# EAGLE design RAMPS_UPS (EAGLE 7.3.0)
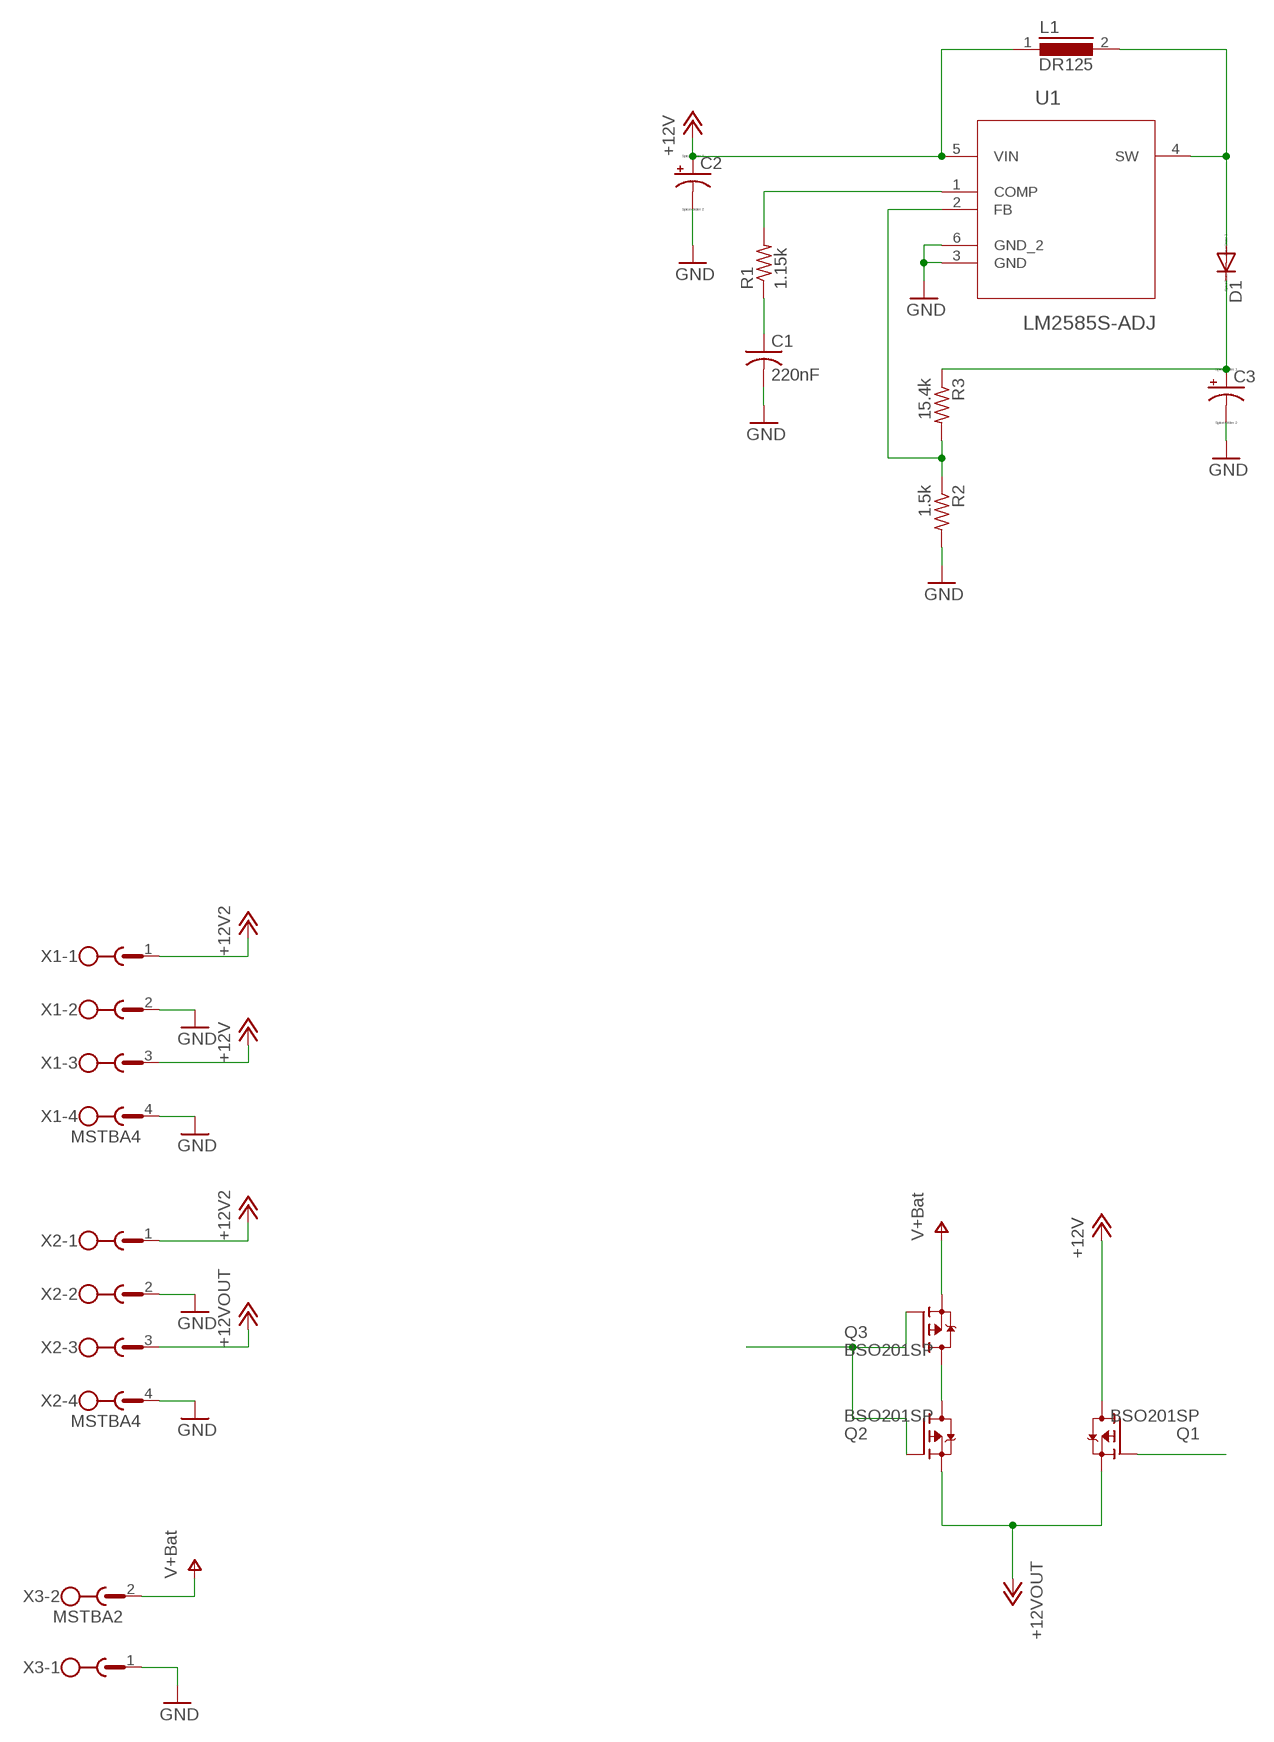
[diagram p0: schematic, sheet 1]

## Parts
C1  220nF  C-USC0805K  [C0805K]
C2  CPOL-USC  [PANASONIC_C]
C3  CPOL-USG  [PANASONIC_G]
D1  DIODE-SMB  [SMB]
L1  DR125  [DR125]
Q1  BSO201SP  [SO-8]
Q2  BSO201SP  [SO-8]
Q3  BSO201SP  [SO-8]
R1  1.15k  R-US_R0805  [R0805]
R2  1.5k  R-US_R0805  [R0805]
R3  15.4k  R-US_R0805  [R0805]
U1  LM2585S-ADJ  [TO170P1435X457-5N]
X1  MSTBA4  [MSTBA4]
X2  MSTBA4  [MSTBA4]
X3  MSTBA2  [MSTBA2]

## Nets
+12V: C2.+ L1.1 U1.5(VIN)
+12V1: Q1.5(D) Q1.6(D) Q1.7(D) Q1.8(D) X1.3 ; supply symbol labelled +12V
+12V2: X1.1 X2.1
+12VOUT: Q1.1(S) Q1.2(S) Q1.3(S) Q2.1(S) Q2.2(S) Q2.3(S) X2.3
GND: C1.2 C2.- C3.- R2.2 U1.3(GND) U1.6(GND_2) X1.2 X1.4 X2.2 X2.4 X3.1
N$1: Q2.5(D) Q2.6(D) Q2.7(D) Q2.8(D) Q3.5(D) Q3.6(D) Q3.7(D) Q3.8(D)
N$2: R2.1 R3.2 U1.2(FB)
N$3: R1.2 U1.1(COMP)
N$4: C1.1 R1.1
N$5: Q2.4(G) Q3.4(G)
N$6: Q1.4(G)
N$7: D1.A L1.2 U1.4(SW)
N$8: C3.+ D1.C
V+: Q3.1(S) Q3.2(S) Q3.3(S) X3.2 ; supply symbol labelled V+Bat
Unconnected: R3.1

## Library data of the parts
C1 = resistor:C-US: CAPACITOR, American symbol
C2 C3 = resistor:CPOL-US: POLARIZED CAPACITOR, American symbol
D1 = diode:DIODE-: DIODE
L1 = inductors:DR125: High Power Density, High Efficiency, Shielded Inductors Source: coiltronics_dr_series.pdf
Q1-Q3 = transistor-fet:BSO201SP: OptiMOS(R)-P Small-Signal-Transistor P-Channel, Enhancement mode, Super Logic Level (2.5 V rated) RDS(on) 8mOhm, ID -14.9 a Source: http://www.infineon.com/upload/Document/cmc_upload/documents/011/3655/BSO201SP_211201.pdf
R1-R3 = resistor:R-US_: RESISTOR, American symbol
U1 = NSC_By_element14_Batch_1.1:LM2585S-ADJ: FLYBACK REGULATOR; MPN: LM2585S-ADJ; OC_FARNELL: 1469182; OC_NEWARK: 41K3722; PACKAGE: TO-263-5; SUPPLIER: National Semiconductor
X1 X2 = con-phoenix-508:MSTBA4: PHOENIX; MF: FARNELL; MPN: 1757268; OC_FARNELL: 3705195; OC_NEWARK: 71C4163
X3 = con-phoenix-508:MSTBA2: PHOENIX; MF: FARNELL; MPN: 1757242; OC_FARNELL: 3705171; OC_NEWARK: 71C4161

## Board
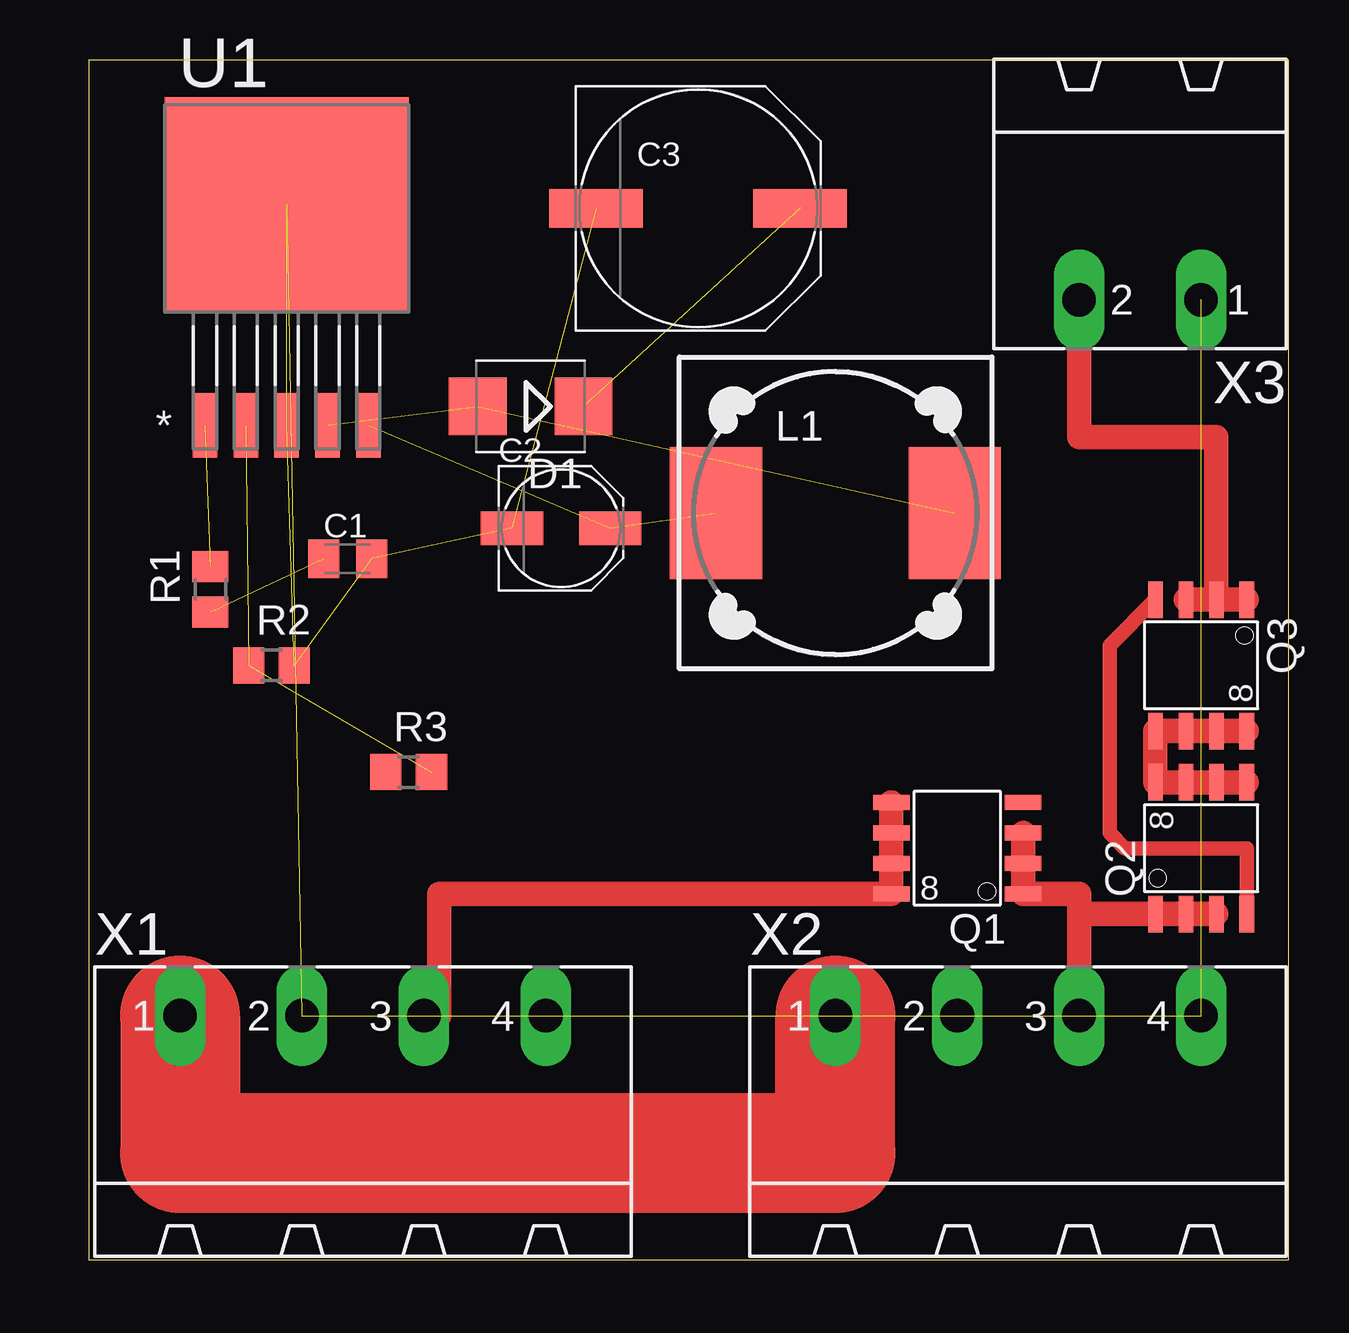
[diagram p1: board, top side]
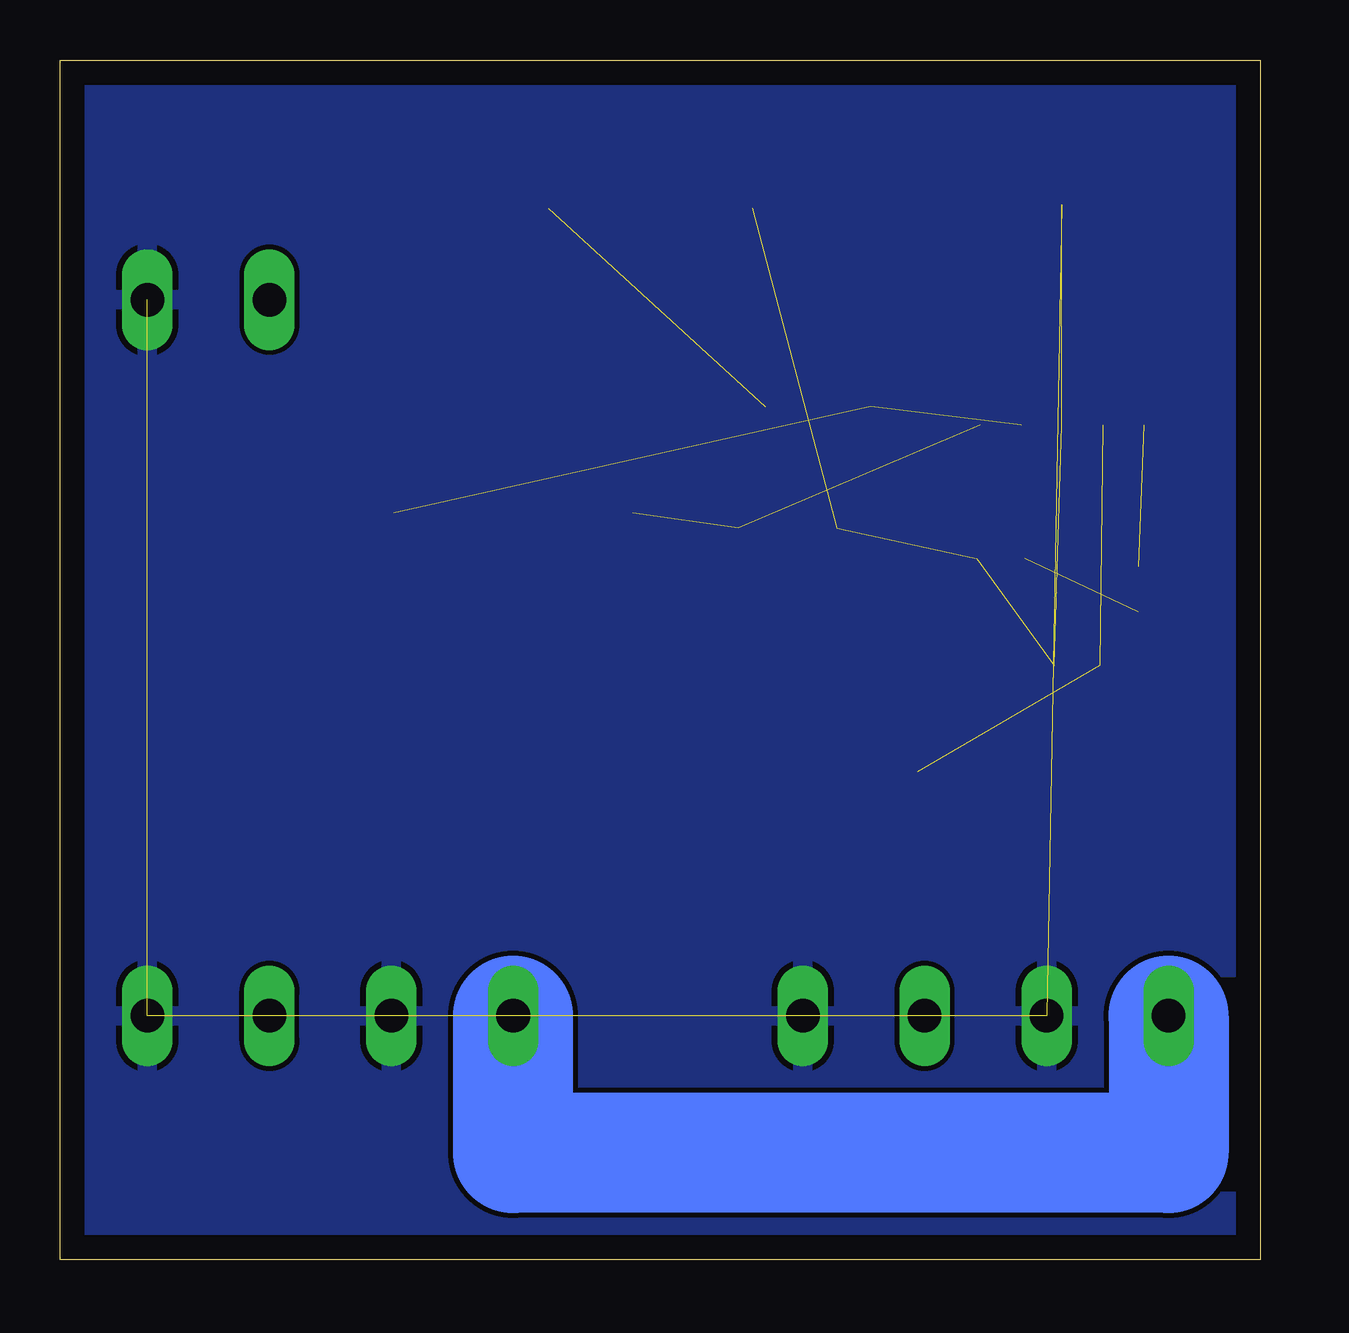
[diagram p2: board, bottom side, seen from below]

Size 50 x 50 mm. Coordinates in mm from the lower left corner, seen from the top.
Outline: 0,0 50,0 50,50 0,50 0,0
Copper layers (1*16): Top 0.035mm / dielectric 1.5mm / Bottom 0.035mm
Design rules "default": minimum track width 10mil, minimum drill 24mil, track to track 8mil, track to pad 8mil, pad to pad 8mil, via to via 8mil, smd to smd 8mil, copper to edge 40mil, drill to drill 8mil, minimum pad ring 10mil, minimum via ring 8mil, stop-mask expansion 4mil, vias tented up to drill 0mil, thermal gap 10mil

### Footprints (pad centres in the part's own frame; a part is rotated, then mirrored left to right if it is on the bottom)
C0805K = smd 1.3 x 1.6: 1 -1,0; 2 1,0
PANASONIC_C = smd 2.6 x 1.4: + 2.05,0; - -2.05,0
PANASONIC_G = smd 3.9 x 1.6: + 4.25,0; - -4.25,0
SMB = smd 2.4 x 2.4: A 2.2,0; C -2.2,0
DR125 = smd 3.85 x 5.5: 1 -4.975,0; 2 4.975,0
SO-8 = smd 1.524 x 0.61: 1 -2.743,1.905; 2 -2.743,0.635; 3 -2.743,-0.635; 4 -2.743,-1.905; 5 2.743,-1.905; 6 2.743,-0.635; 7 2.743,0.635; 8 2.743,1.905
R0805 = smd 1.3 x 1.5: 1 -0.95,0; 2 0.95,0
TO170P1435X457-5N = smd 1.016 x 2.692: 1 -3.404,-9.042; 2 -1.702,-9.042; 3 0,-9.042; 4 1.702,-9.042; 5 3.404,-9.042 | smd 10.16 x 8.941: 6 0,0.152
MSTBA4 = drill 1.397 long: 1 -7.62,5.08; 2 -2.54,5.08; 3 2.54,5.08; 4 7.62,5.08
MSTBA2 = drill 1.397 long: 1 -2.54,5.08; 2 2.54,5.08

### Placement (x,y rotation side)
C1  10.79,29.21 0 top
C2  19.68,30.48 0 top
C3  25.4,43.81 0 top
D1  18.41,35.56 180 top
L1  31.11,31.11 0 top
Q1  36.2,17.14 180 top
Q2  46.35,17.14 90 top
Q3  46.35,24.77 270 top
R1  5.08,27.94 90 top
R2  7.62,24.77 0 top
R3  13.34,20.32 0 top
U1  8.26,43.81 0 top
X1  11.43,5.08 0 top
X2  38.73,5.08 0 top
X3  43.81,45.09 180 top

### Tracks (layer width: path | path; a pad name or v marks a point on that pad's centre or on a via)
+12V  (2 unrouted)
+12V1
  Top 1.016: X1.3 14.61,10.16 14.61,15.24 Q1.8 Q1.7 Q1.6 Q1.5
+12V2
  Top 5: X1.1 3.81,4.45 31.11,4.45 X2.1
  Bottom 5: X1.1 3.81,4.45 31.11,4.45 X2.1
+12VOUT
  Top 1.016: Q1.3 Q1.2 Q1.1 41.27,15.24 41.27,14.4 | Q2.1 Q2.2 Q2.3 41.27,14.4 | 41.27,14.4 X2.3
GND  (10 unrouted)
  pour Bottom: 0,0 50,0 50,50 0,50
N$1
  Top 1.016: Q2.5 Q2.6 Q2.7 Q2.8 Q3.5 Q3.6 Q3.7 Q3.8
N$2  (2 unrouted)
N$3  (1 unrouted)
N$4  (1 unrouted)
N$5
  Top 0.61: Q2.4 48.26,17.14 43.18,17.14 42.55,17.78 42.55,25.6 Q3.4
N$7  (2 unrouted)
N$8  (1 unrouted)
V+
  Top 1.016: Q3.3 Q3.2 | Q3.2 Q3.1 | X3.2 41.27,34.29 46.99,34.29 Q3.2